# Altium schematic sheet V2LinearArray.SchDoc
size A; DocumentNumber: 6; SheetNumber: 6; SheetTotal: 6
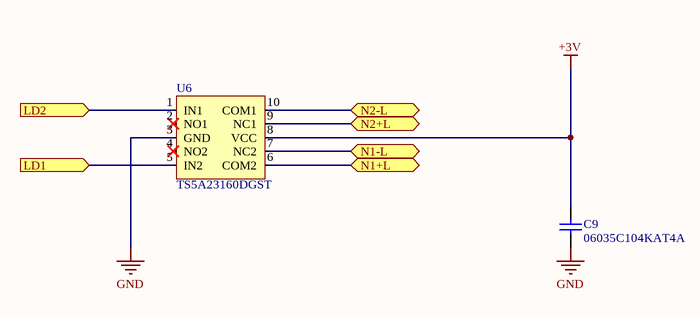
[diagram p0: V2LinearArray.SchDoc]

## Parts
C9  06035C104KAT4A  [CAPC1608X90X35LL15T15]
U6  TS5A23160DGST  [TSSOP50P490X110-10N]

## Ports
LD1 (in), LD2 (in), N1+L (bidir), N1-L (bidir), N2+L (bidir), N2-L (bidir)

## Nets
+3V: C9.1 U6.8(VCC)
GND: C9.2 U6.3(GND)
LD1: U6.5(IN2) ; port LD1
LD2: U6.1(IN1) ; port LD2
N1+L: U6.6(COM2) ; port N1+L
N1-L: U6.7(NC2) ; port N1-L
N2+L: U6.9(NC1) ; port N2+L
N2-L: U6.10(COM1) ; port N2-L

Not connected (* = marked no-connect by the designer): U6 2(NO1)* 4(NO2)*

## Library data of the parts
C9 = CMP-2006-04390-1: Manufacturer: AVX Interconnect / Elco; Part Number: 06035C104KAT4A
U6 = CMP-011-00013-3: 0.9-Ω on-state resistance, 5-V, 2: 1 (SPDT), 2-channel analog switch 10-VSSOP -40 to 85